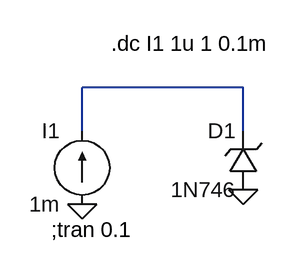
[diagram p0: schematic Draft1.asc]
Draft1.asc, the LTspice schematic file:
Version 4
SHEET 1 880 680
WIRE 352 80 176 80
WIRE 176 128 176 80
WIRE 352 128 352 80
FLAG 176 208 0
FLAG 352 192 0
SYMBOL zener 368 192 R180
WINDOW 0 24 64 Left 2
WINDOW 3 24 0 Left 2
SYMATTR InstName D1
SYMATTR Value 1N746
SYMBOL current 176 208 R180
WINDOW 0 24 80 Left 2
WINDOW 3 24 0 Left 2
WINDOW 123 0 0 Left 0
WINDOW 39 0 0 Left 0
SYMATTR InstName I1
SYMATTR Value 1m
TEXT 142 236 Left 2 !;tran 0.1
TEXT 208 32 Left 2 !.dc I1 1u 1 0.1m

The netlist it stands for:
* Draft1.asc
D1 0 N001 1N746
I1 0 N001 1m
.model D D
.lib standard.dio
;tran 0.1
.dc I1 1u 1 0.1m
.backanno
.end